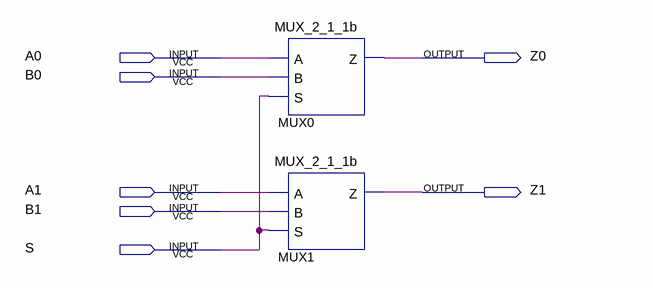
[diagram p0: schematic sheet]
// Quartus schematic MUX_2_1_2b.bdf as structural Verilog: 2 symbols, 7 pins
module MUX_2_1_2b (
  input  A0,
  input  B0,
  input  A1,
  input  B1,
  input  S,
  output Z0,
  output Z1
);

  MUX_2_1_1b MUX0 (.A(A0), .B(B0), .S(S), .Z(Z0));
  MUX_2_1_1b MUX1 (.A(A1), .B(B1), .S(S), .Z(Z1));
endmodule
